# EasyEDA schematic SCH_STMv2_2025-09-21.json

## Sheets
1 stepper driver: TITLE: Sheet_1; REV: 1.0; Date: 2025-07-05; Sheet: 1/1; Drawn By: ZacApelt; Company: Your Company
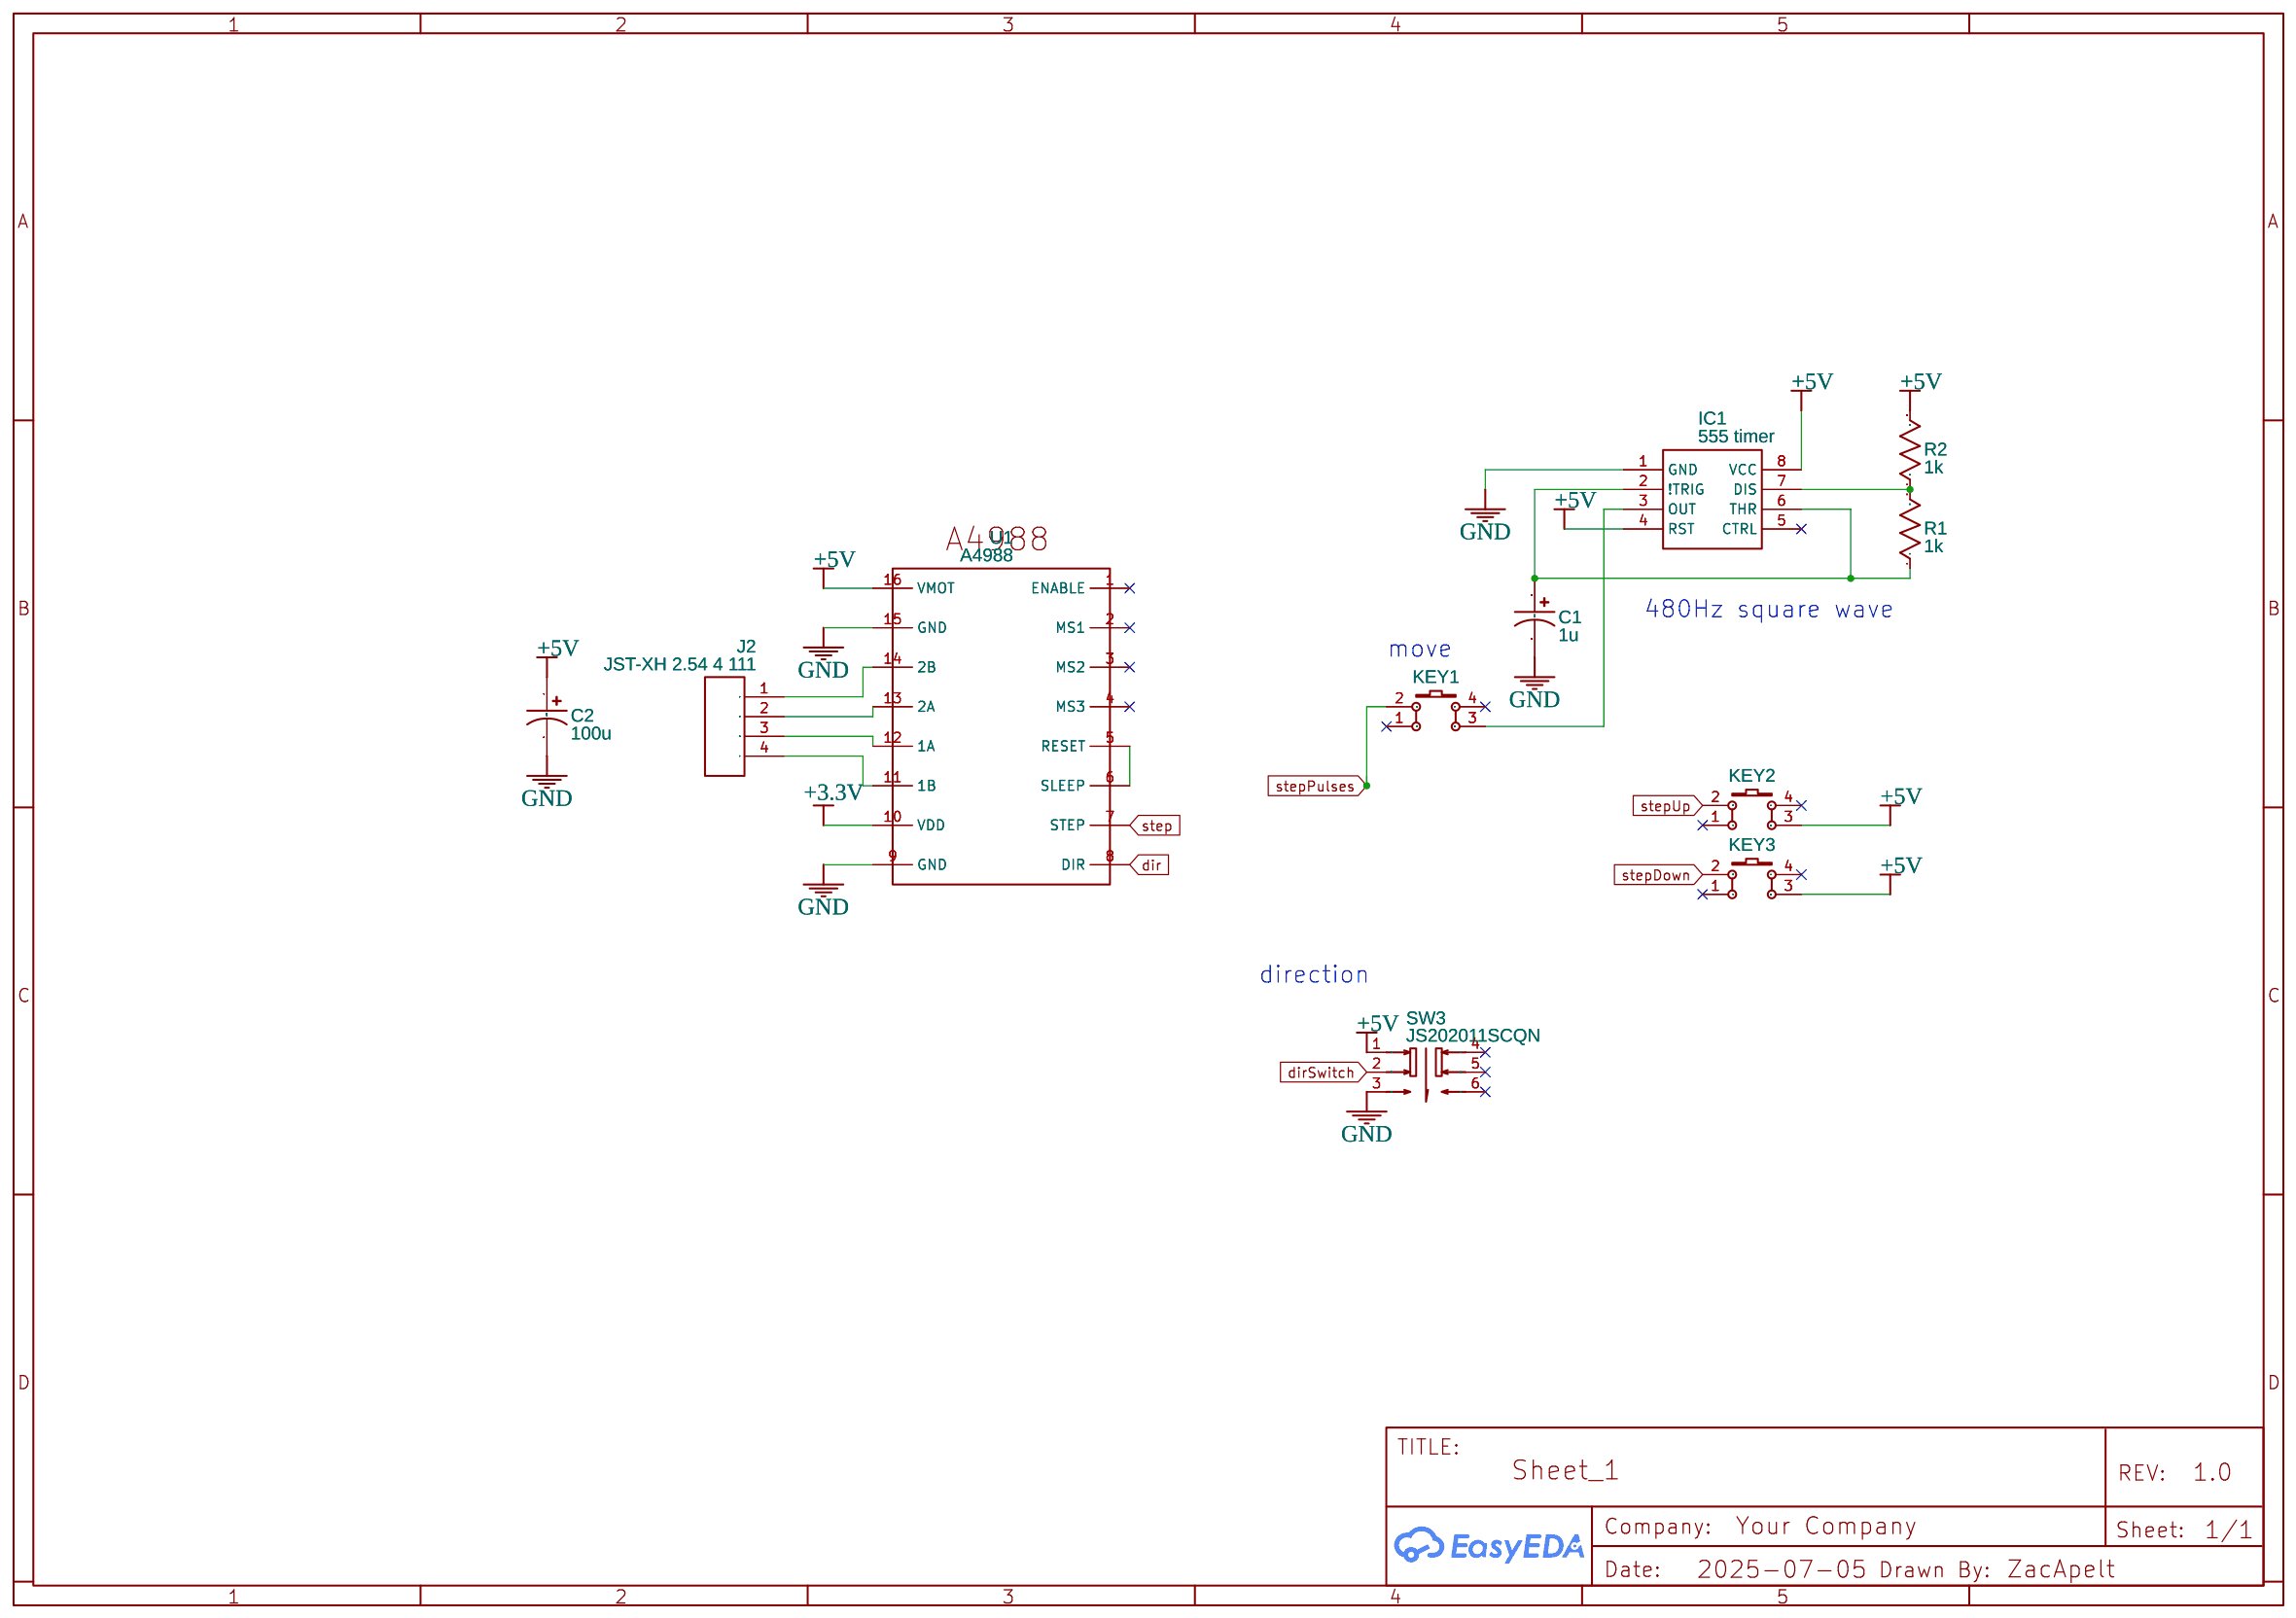
[diagram p0: stepper driver]
2 preamp
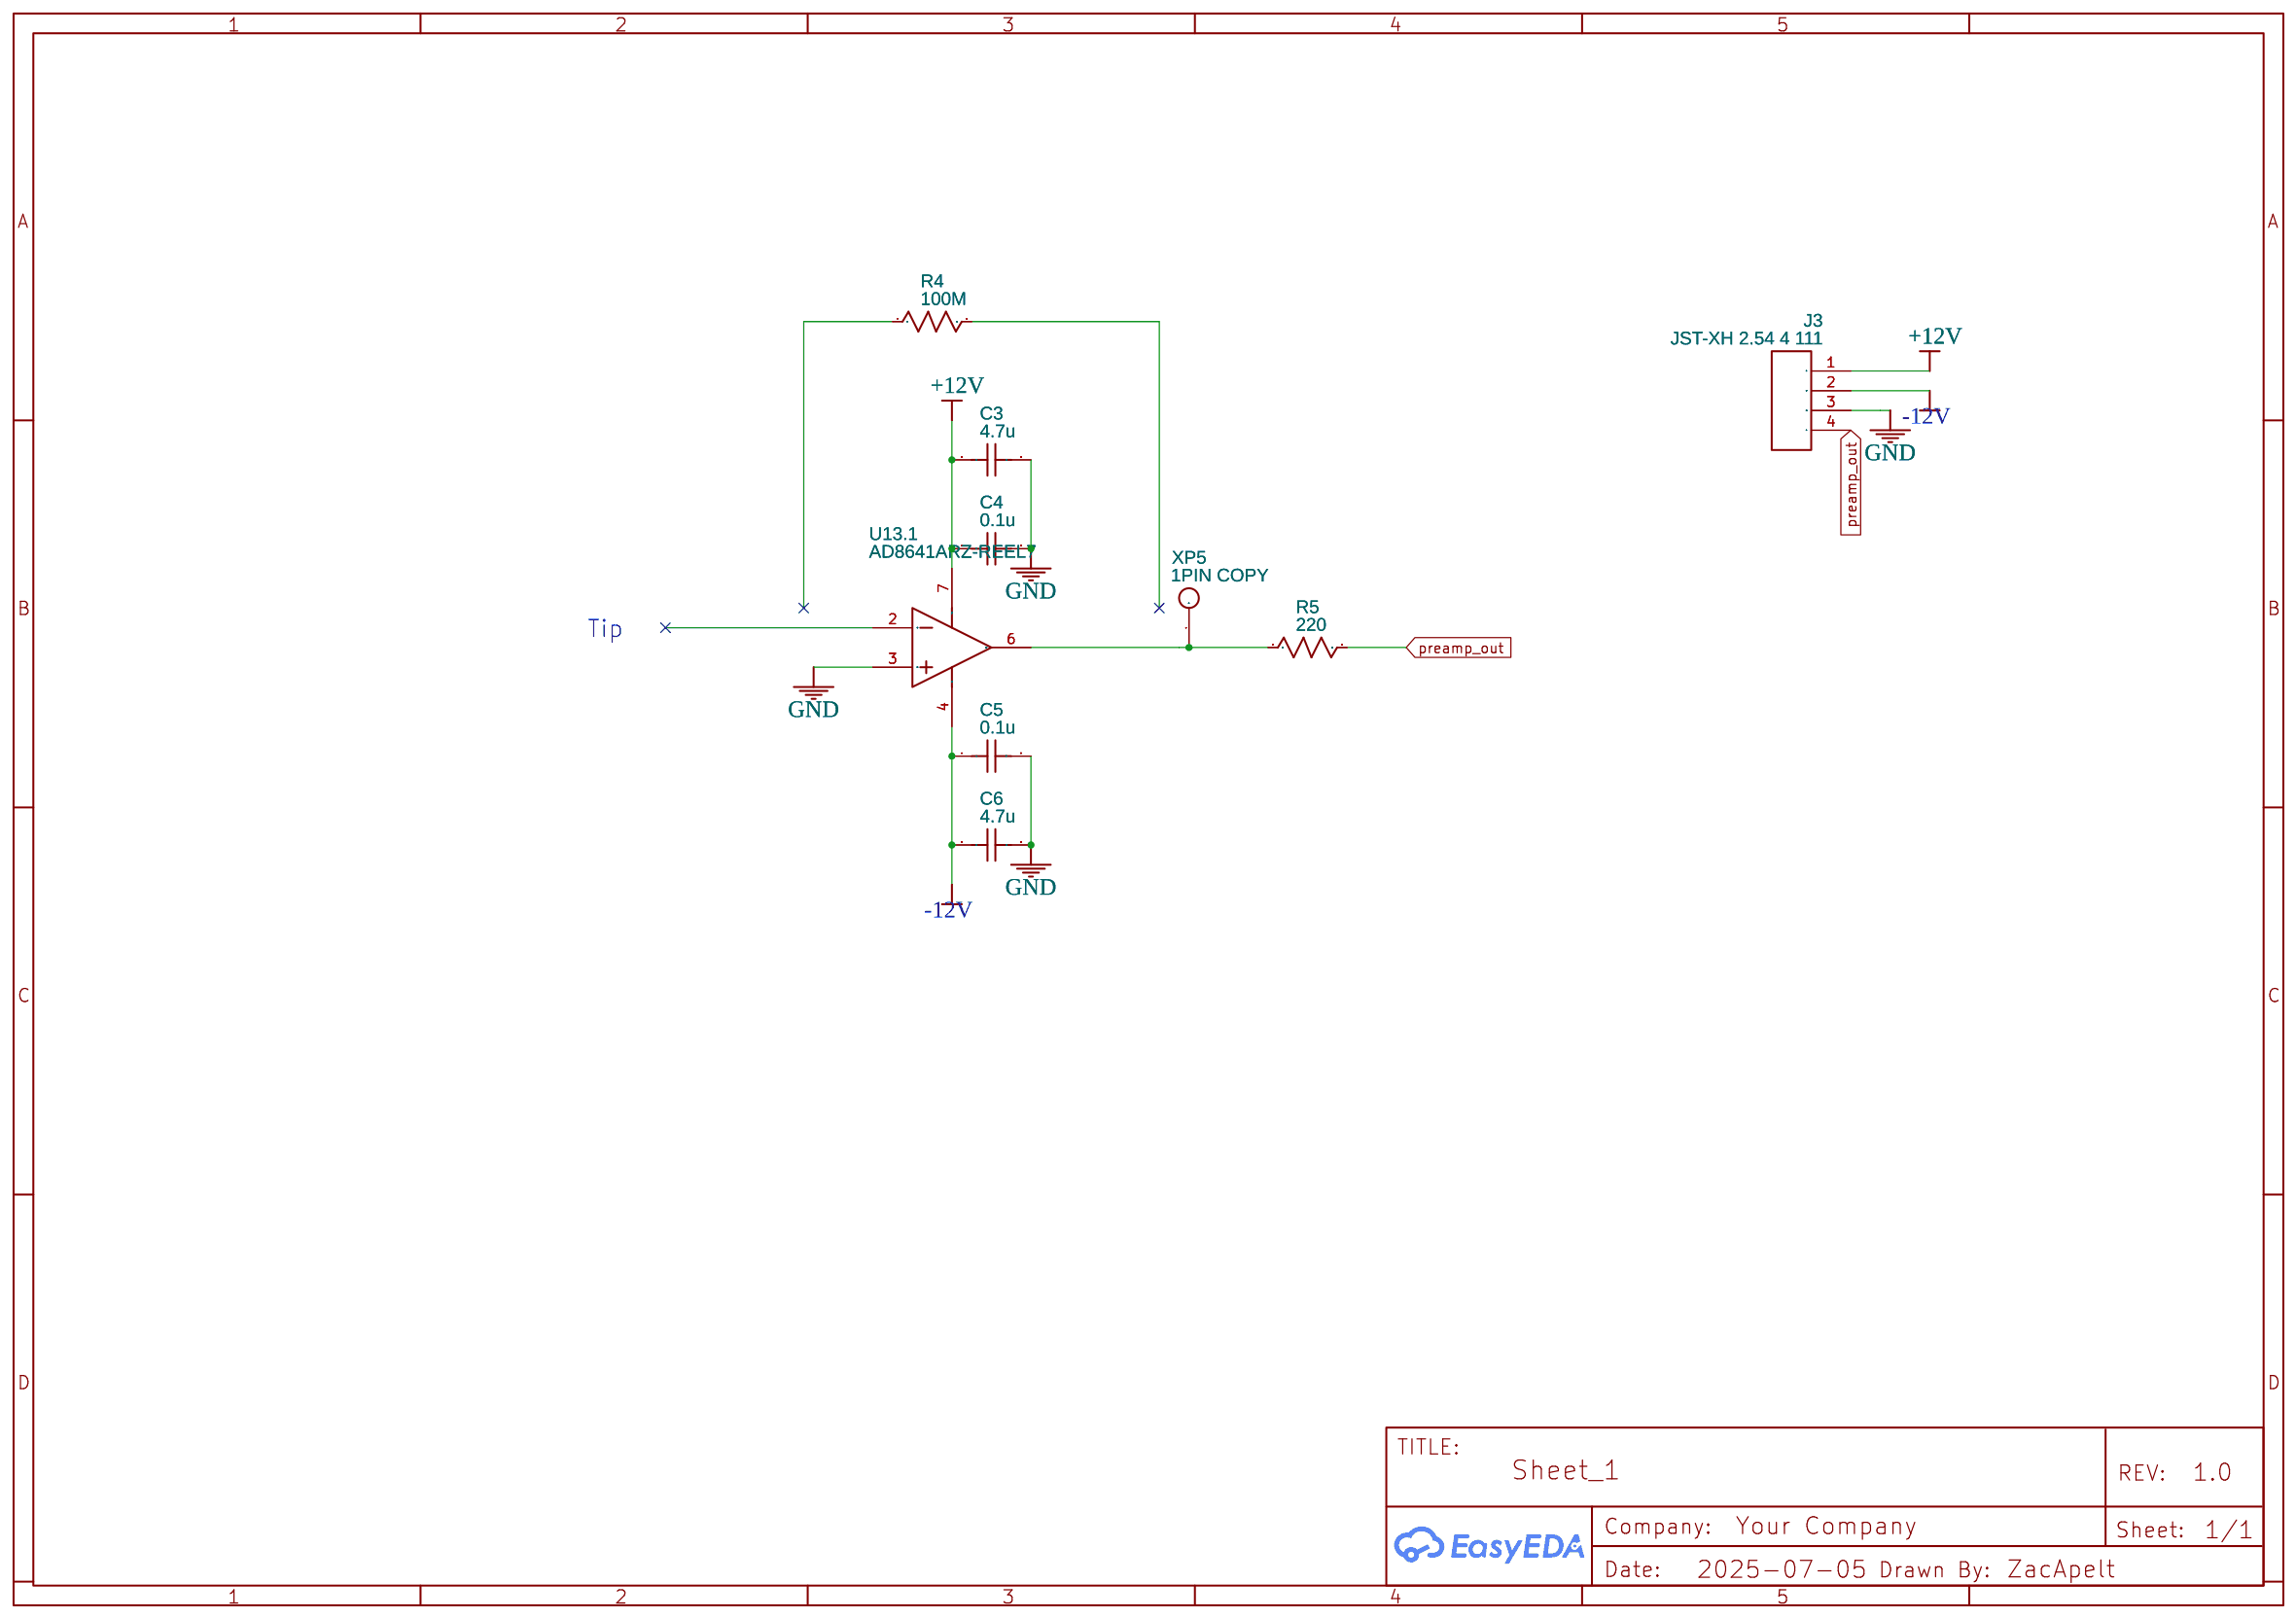
[diagram p1: preamp]
3 Control loop
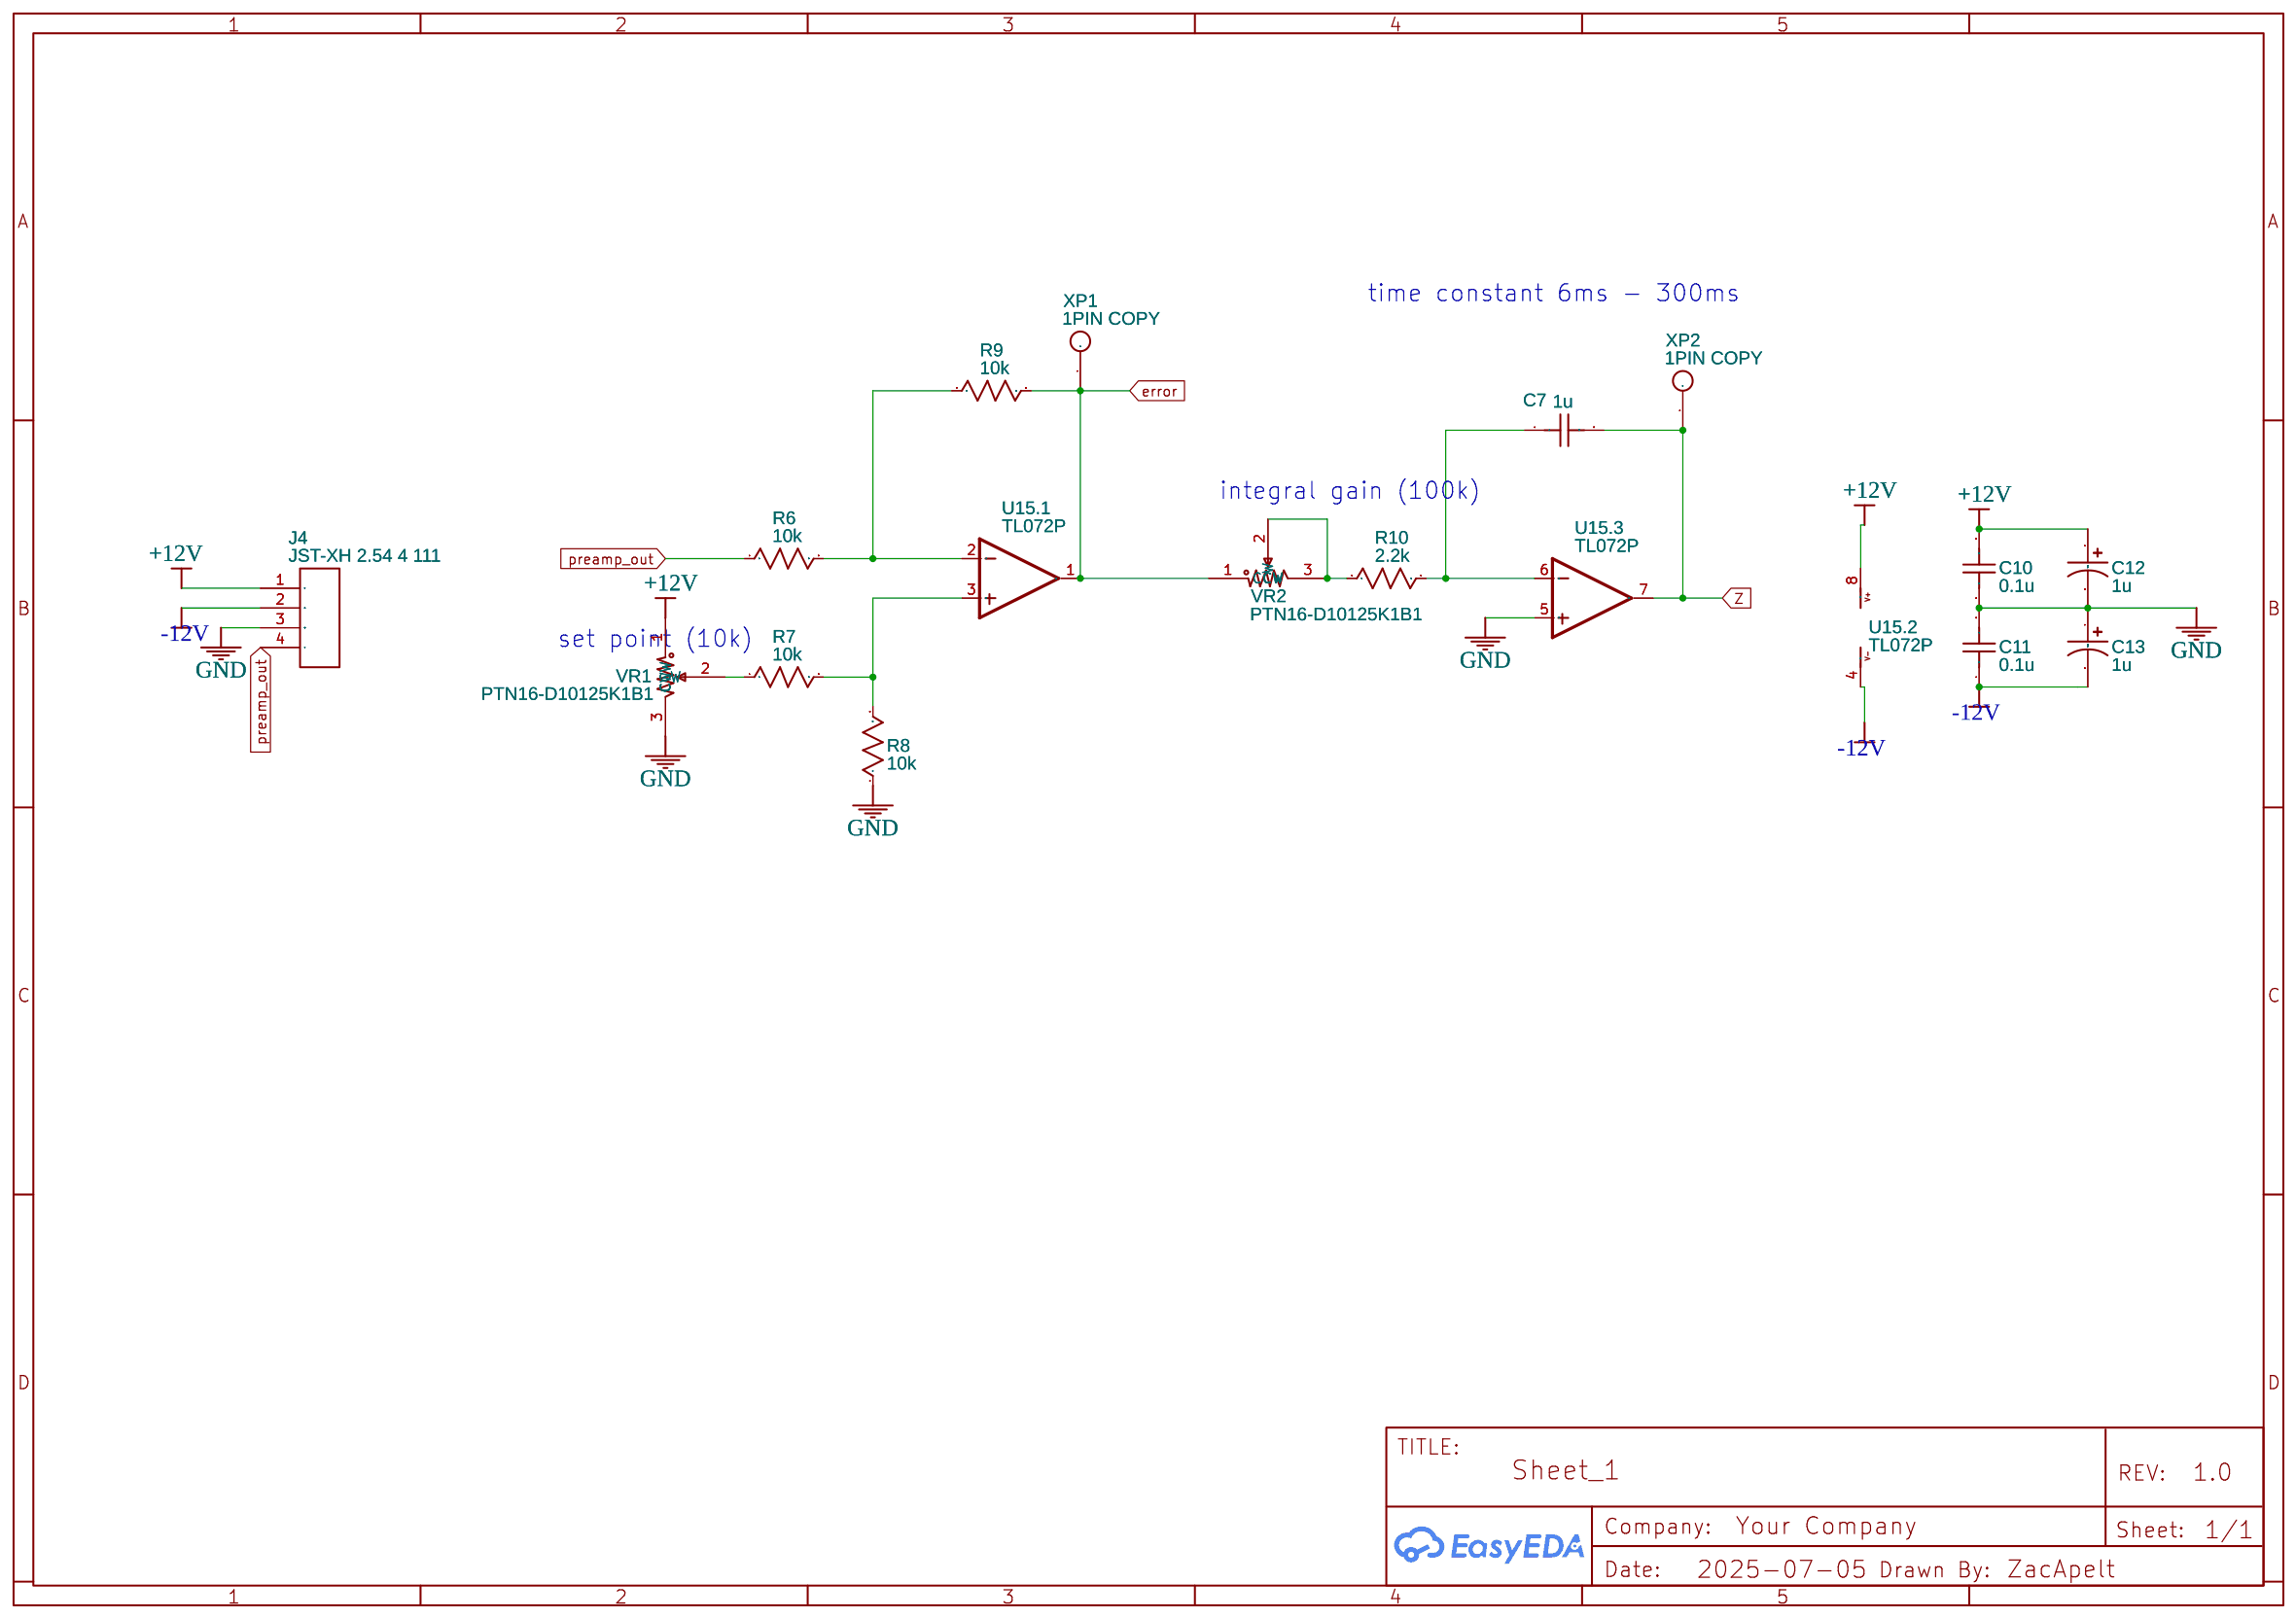
[diagram p2: Control loop]
4 piezo driver
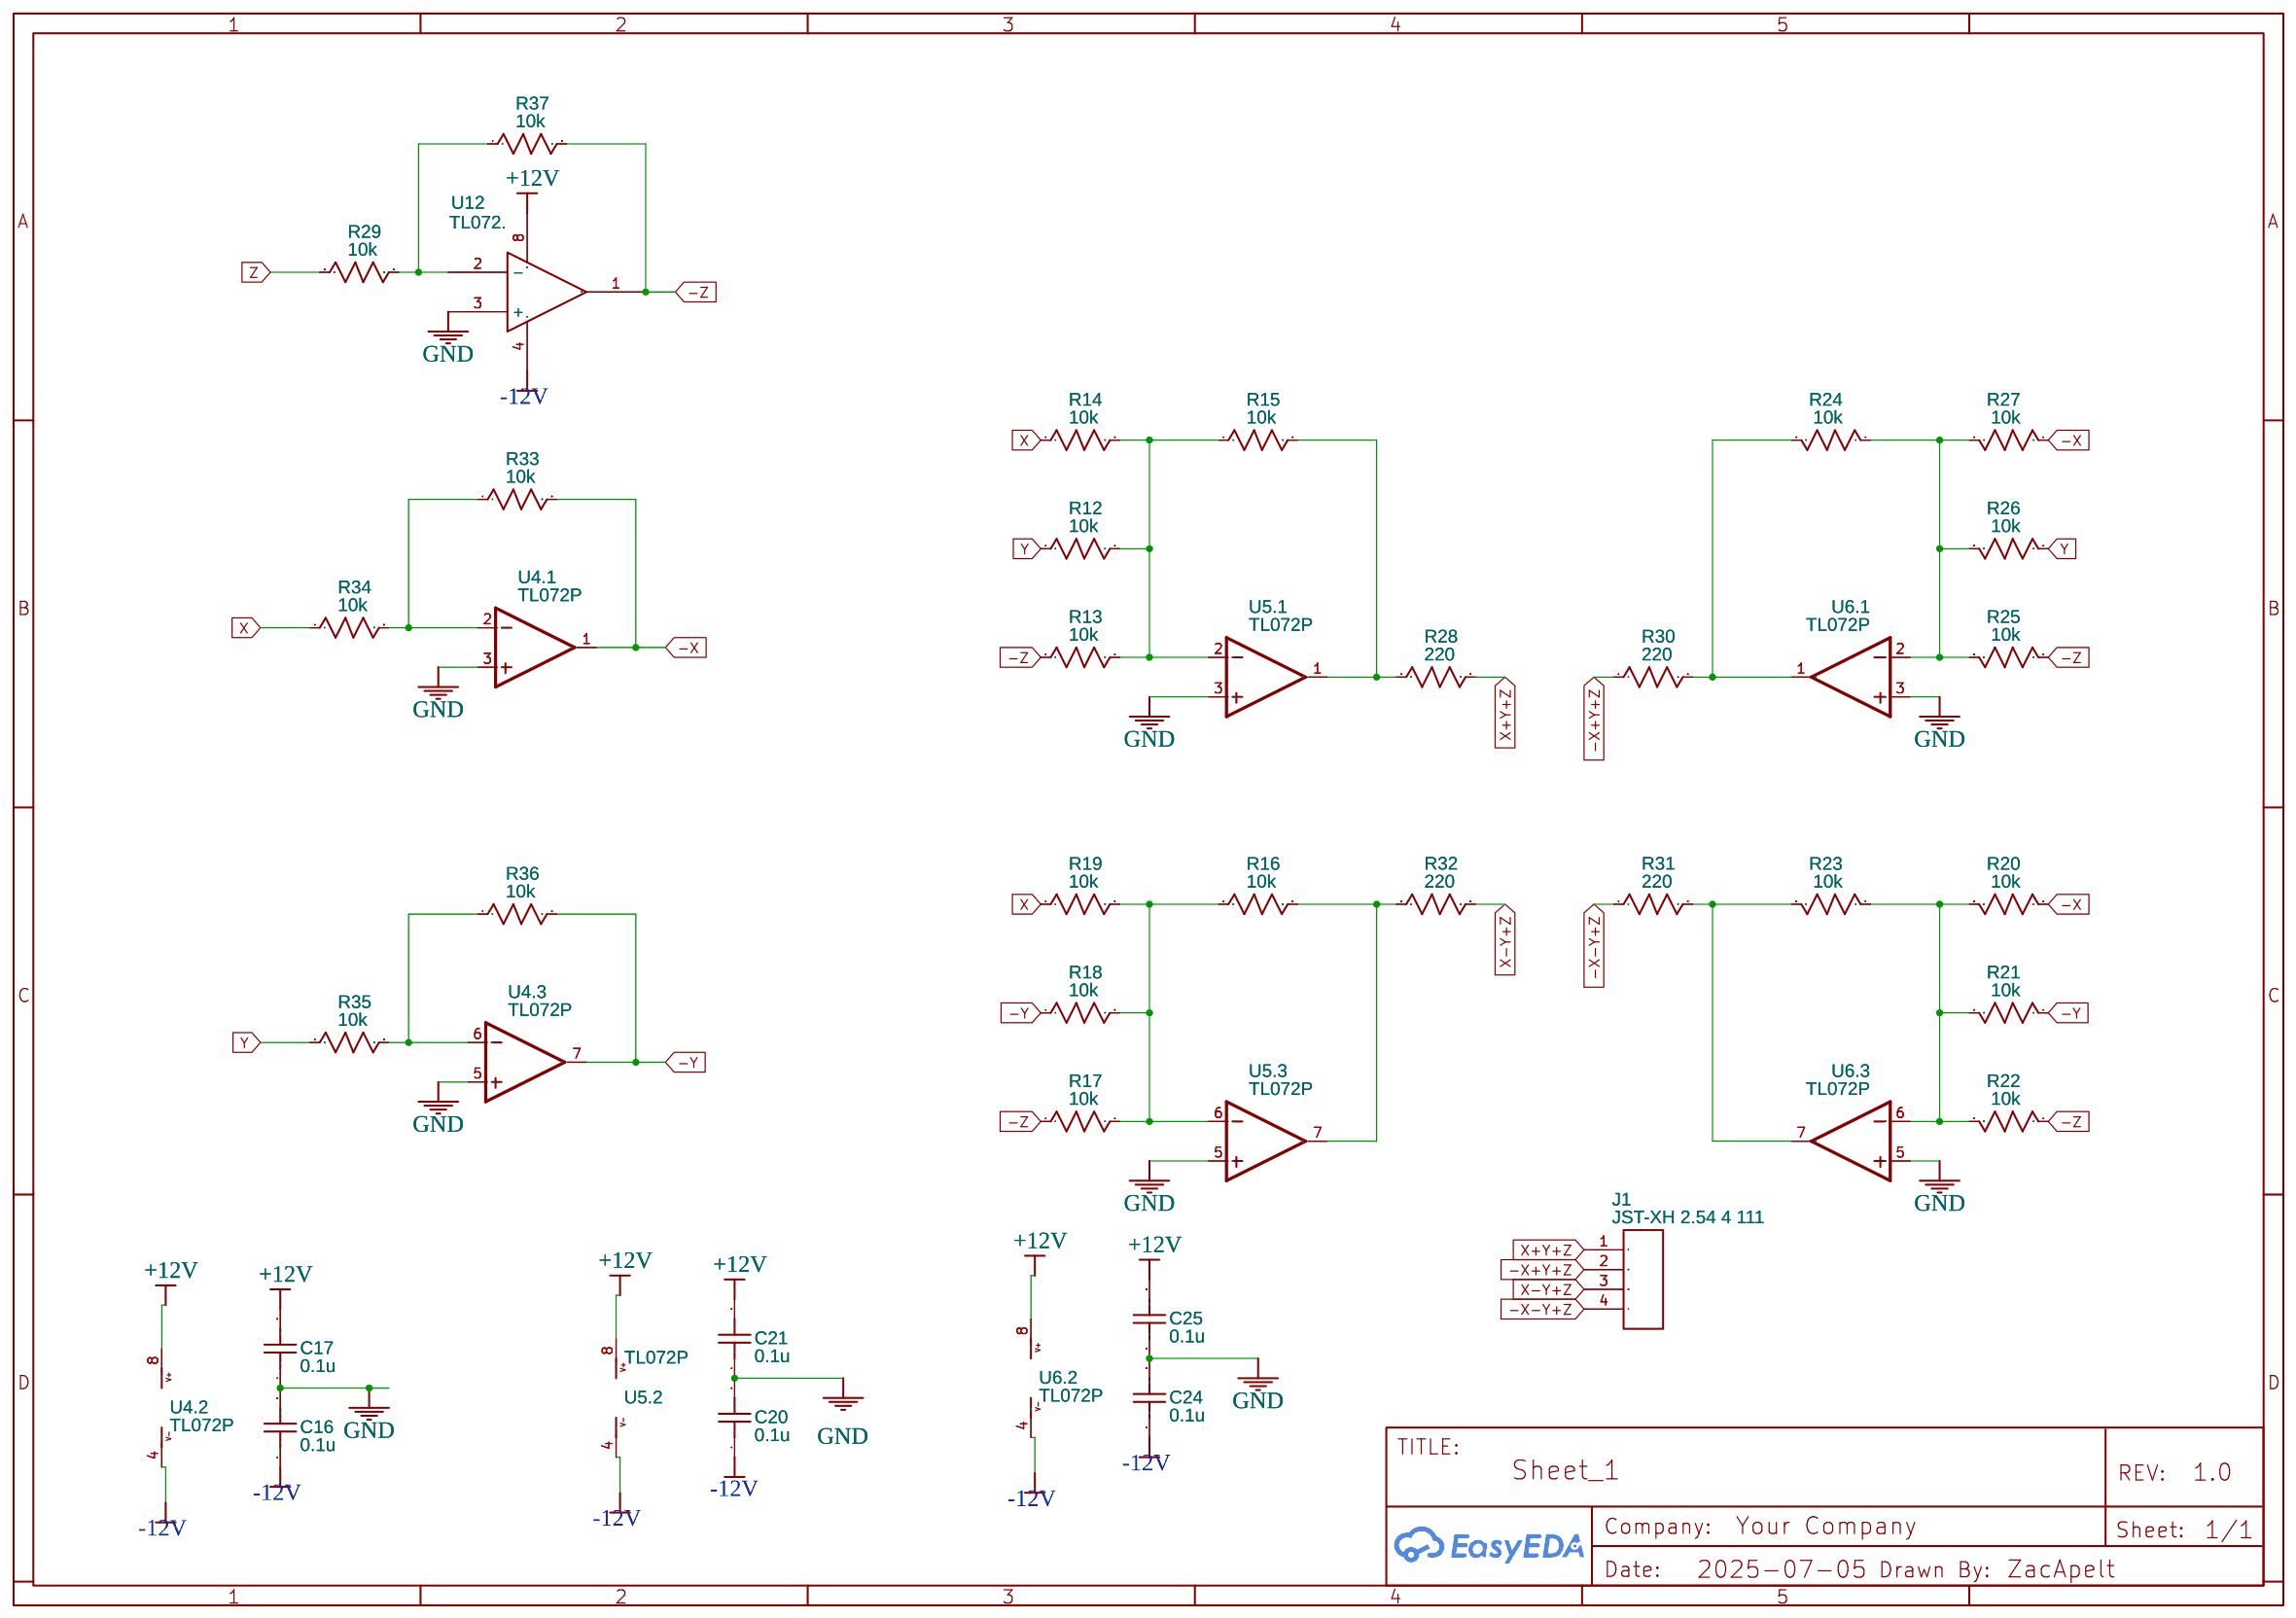
[diagram p3: piezo driver]
5 Pico Control: Date: 2025-07-13
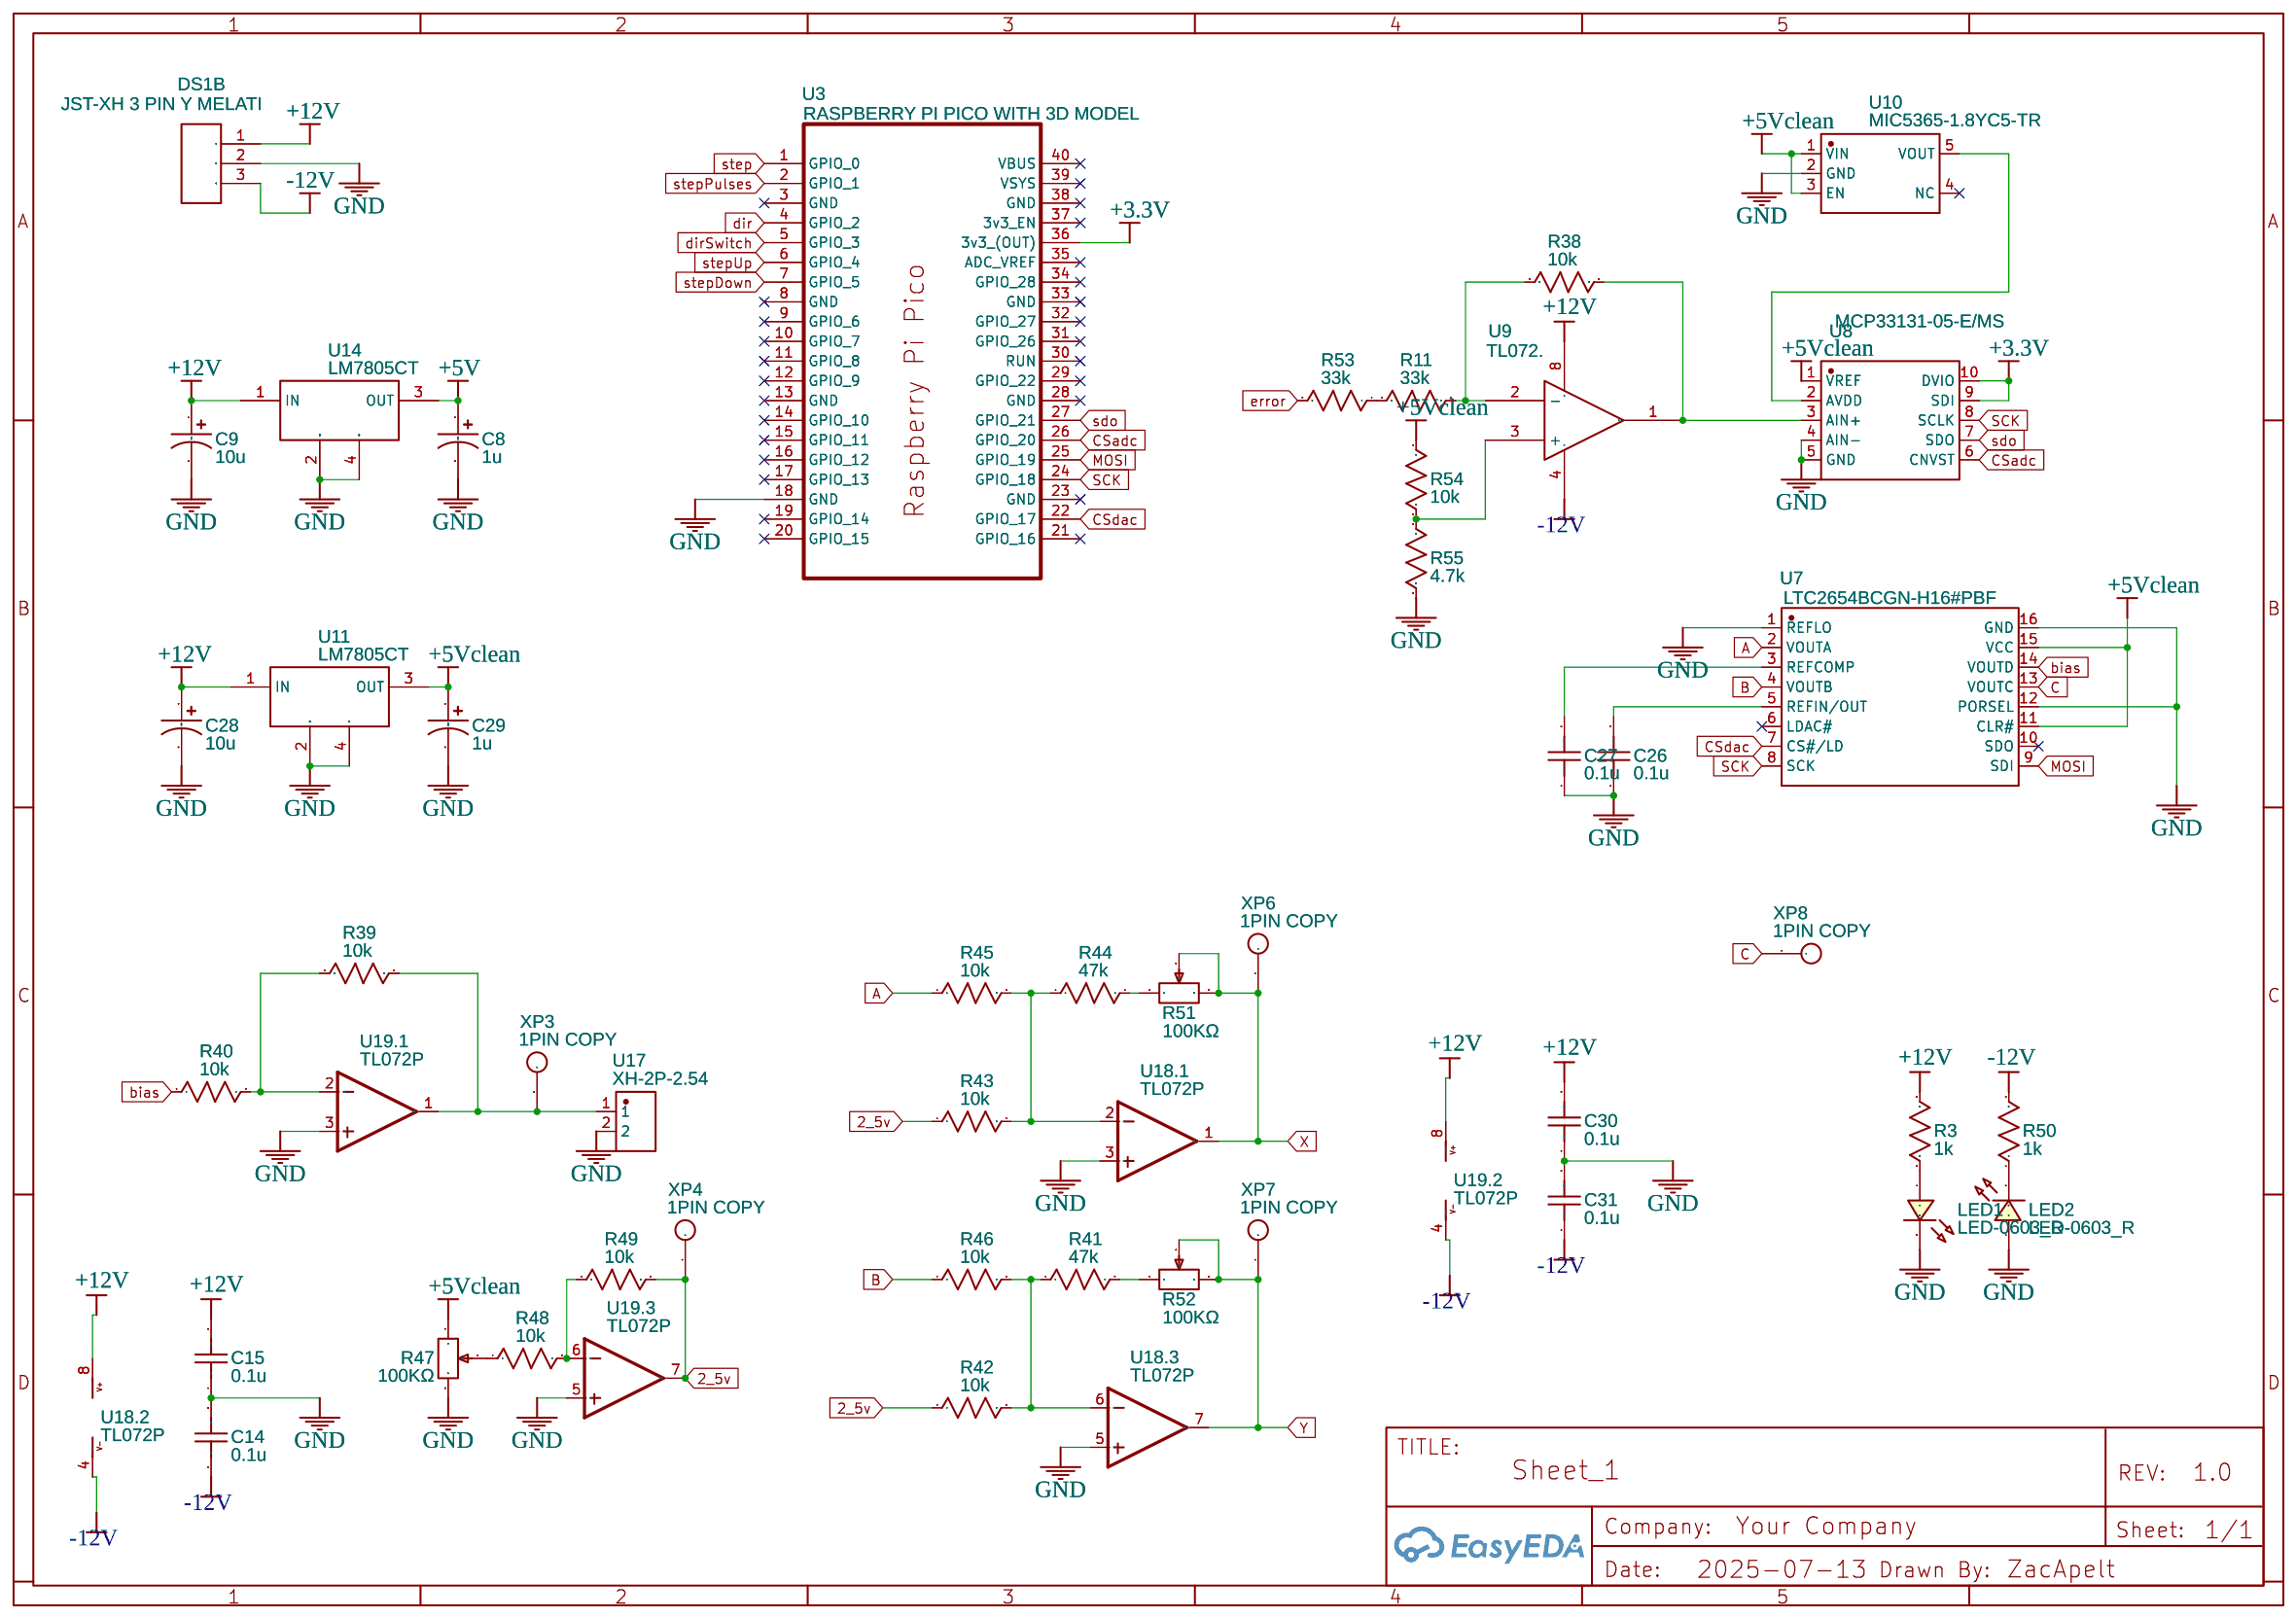
[diagram p4: Pico Control]

## Parts
sheet Control loop
C7  1u  [C0603]
C10  0.1u  [C0603]
C11  0.1u  [C0603]
C12  1u  [CAP-D5.0×F2.0]
C13  1u  [CAP-D5.0×F2.0]
J4  JST-XH 2.54 4 111  [4PIN_2.54_MM_JST_XHP_JST_CONNECTOR_FOR_DC_SOCKET]
R6  10k  [R0603]
R7  10k  [R0603]
R8  10k  [R0603]
R9  10k  [R0603]
R10  2.2k  [R0603]
U15  TL072P  [TL072P]  (sections 1,2,3)
VR1  PTN16-D10125K1B1  [PTN16D10125K1B1]
VR2  PTN16-D10125K1B1  [PTN16D10125K1B1]
XP1  1PIN COPY  [PIN1_RED COPY]
XP2  1PIN COPY  [PIN1_RED COPY]
sheet Pico Control
C8  1u  [CAP-D5.0×F2.0]
C9  10u  [CAP-D5.0×F2.0]
C14  0.1u  [C0603]
C15  0.1u  [C0603]
C26  0.1u  [C0603]
C27  0.1u  [C0603]
C28  10u  [CAP-D5.0×F2.0]
C29  1u  [CAP-D5.0×F2.0]
C30  0.1u  [C0603]
C31  0.1u  [C0603]
DS1B  JST-XH 3 PIN Y MELATI  [3PIN_2.54_MM_JST_XHP_JST_CONNECTOR_FOR_DC_SOCKET]
LED1  LED-0603_R  [LED0603_RED]
LED2  LED-0603_R  [LED0603_RED]
R3  1k  [R0603]
R11  33k  [R0603]
R38  10k  [R0603]
R39  10k  [R0603]
R40  10k  [R0603]
R41  47k  [R0603]
R42  10k  [R0603]
R43  10k  [R0603]
R44  47k  [R0603]
R45  10k  [R0603]
R46  10k  [R0603]
R47  100KΩ  [RES-ADJ_3296W]
R48  10k  [R0603]
R49  10k  [R0603]
R50  1k  [R0603]
R51  100KΩ  [RES-ADJ_3296W]
R52  100KΩ  [RES-ADJ_3296W]
R53  33k  [R0603]
R54  10k  [R0603]
R55  4.7k  [R0603]
U3  RASPBERRY PI PICO WITH 3D MODEL  [RASPBERRY PI PICO/ RASPBERRY PI PICO W]
U7  LTC2654BCGN-H16#PBF  [SSOP-16_L4.9-W3.9-P0.64-LS6.0-BL]
U8  MCP33131-05-E/MS  [MSOP-10_L3.0-W3.0-P0.50-LS4.9-BL]
U9  TL072.  [TL072]
U10  MIC5365-1.8YC5-TR  [SC-70-5_L2.0-W1.3-P0.65-LS2.1-BL]
U11  LM7805CT  [LM7805CT/SX]
U14  LM7805CT  [LM7805CT/SX]
U17  XH-2P-2.54  [CONN-TH_2P-P2.50-XH2.54-2P]
U18  TL072P  [TL072P]  (sections 1,2,3)
U19  TL072P  [TL072P]  (sections 1,2,3)
XP3  1PIN COPY  [PIN1_RED COPY]
XP4  1PIN COPY  [PIN1_RED COPY]
XP6  1PIN COPY  [PIN1_RED COPY]
XP7  1PIN COPY  [PIN1_RED COPY]
XP8  1PIN COPY  [PIN1_RED COPY]
sheet piezo driver
C16  0.1u  [C0603]
C17  0.1u  [C0603]
C20  0.1u  [C0603]
C21  0.1u  [C0603]
C24  0.1u  [C0603]
C25  0.1u  [C0603]
J1  JST-XH 2.54 4 111  [4PIN_2.54_MM_JST_XHP_JST_CONNECTOR_FOR_DC_SOCKET]
R12  10k  [R0603]
R13  10k  [R0603]
R14  10k  [R0603]
R15  10k  [R0603]
R16  10k  [R0603]
R17  10k  [R0603]
R18  10k  [R0603]
R19  10k  [R0603]
R20  10k  [R0603]
R21  10k  [R0603]
R22  10k  [R0603]
R23  10k  [R0603]
R24  10k  [R0603]
R25  10k  [R0603]
R26  10k  [R0603]
R27  10k  [R0603]
R28  220  [R0603]
R29  10k  [R0603]
R30  220  [R0603]
R31  220  [R0603]
R32  220  [R0603]
R33  10k  [R0603]
R34  10k  [R0603]
R35  10k  [R0603]
R36  10k  [R0603]
R37  10k  [R0603]
U4  TL072P  [TL072P]  (sections 1,2,3)
U5  TL072P  [TL072P]  (sections 1,2,3)
U6  TL072P  [TL072P]  (sections 1,2,3)
U12  TL072.  [TL072]
sheet preamp
C3  4.7u  [C0603]
C4  0.1u  [C0603]
C5  0.1u  [C0603]
C6  4.7u  [C0603]
J3  JST-XH 2.54 4 111  [4PIN_2.54_MM_JST_XHP_JST_CONNECTOR_FOR_DC_SOCKET]
R4  100M  [R0603]
R5  220  [R0603]
U13  AD8641ARZ-REEL7  [SOIC-8_L4.9-W3.9-P1.27-LS6.0-TL]  (section 1)
XP5  1PIN COPY  [PIN1_RED COPY]
sheet stepper driver
C1  1u  [CAP-D5.0×F2.0]
C2  100u  [CAP-D5.0×F2.0]
IC1  555 timer  [555TIMER]
J2  JST-XH 2.54 4 111  [4PIN_2.54_MM_JST_XHP_JST_CONNECTOR_FOR_DC_SOCKET]
KEY1  K4-6×6_SMD  [KEY-SMD_4P-L6.0-W6.0-P3.90-LS10.0]
KEY2  K4-6×6_SMD  [KEY-SMD_4P-L6.0-W6.0-P3.90-LS10.0]
KEY3  K4-6×6_SMD  [KEY-SMD_4P-L6.0-W6.0-P3.90-LS10.0]
R1  1k  [R0603]
R2  1k  [R0603]
SW3  JS202011SCQN  [SW-SMD_JS202011SCQN]
U1  A4988  [A4988]

## Library data of the parts
C3-C7 C10 C11 C14-C17 C20 C21 C24-C27 C30 C31 = C_0603_US: Contributor: LCEDA_Lib
C1 C2 C8 C9 C12 C13 C28 C29 = CE_TH_D5.0×F2.0_US: Contributor: LCEDA_Lib
J1-J4 = JST-XH 2.54 4 111: Contributor: moorpcbs
R1-R46 R48-R50 R53-R55 = R_0603_US: Contributor: LCEDA_Lib
U4-U6 U15 U18 U19 = TL072P: Manufacturer: The Art of Electronics; Manufacturer Part: The Art of Electronics; Supplier Part: The Art of Electronics; Contributor: dood556; subpart_no: 1
VR1 VR2 = PTN16-D10125K1B1
XP1-XP8 = 1PIN COPY: Contributor: kimdaihai
DS1B = JST-XH 3 PIN Y MELATI: Contributor: susiloseptember
LED1 LED2 = LED-0603_R: Manufacturer: EVERLIGHT(台湾亿光); Manufacturer Part: 19-217/R6C-AL1M2VY/3T; Supplier Part: C72044; Supplier: LCSC; Contributor: LCEDA_01
R47 R51 R52 = 3296W-1-104LF: Supplier: LCSC; Manufacturer: Bochen; Contributor: LCSC; Supplier Part: C118963
U3 = RASPBERRY PI PICO WITH 3D MODEL: Contributor: sunilgoud410
U7 = LTC2654BCGN-H16#PBF: Contributor: LCSC; Supplier: LCSC; Supplier Part: C682417; Manufacturer: ADI(亚德诺)
U8 = MCP33131-05-E/MS: Contributor: lcsc; Supplier: LCSC; Supplier Part: C635975; Manufacturer: MICROCHIP(美国微芯); JLCPCB Part Class: Extended Part
U9 U12 = TL072.: Contributor: pshiuu; subpart_no: 2
U10 = MIC5365-1.8YC5-TR: Contributor: LCSC; Supplier: LCSC; Supplier Part: C626087; Manufacturer: MICROCHIP(美国微芯); JLCPCB Part Class: Extended Part
U11 U14 = LM7805CT: Manufacturer: TI; Manufacturer Part: LM7805CT/NOPB; Supplier Part: LM7805CT/NOPB; link: http:; Contributor: lamngo
U17 = XH-2P-2.54: Contributor: LCSC; Convert to PCB: Yes; Add into BOM: Yes; Supplier: LCSC; Supplier Part: C9900003929; Manufacturer: null; JLCPCB Part Class: Extended Part
U13 = AD8641ARZ-REEL7: subpart_no: 1; Supplier: LCSC; Supplier Part: C207687; Manufacturer: ADI(亚德诺); JLCPCB Part Class: Extended Part
IC1 = 555 timer: Contributor: MacAfeeje
KEY1-KEY3 = K4-6×6_SMD: Supplier Part: C191626; Supplier: LCSC; Manufacturer: 韩国韩荣; Manufacturer Part: K2-6639SP-D4SC-04; Contributor: LCEDA_Lib
SW3 = JS202011SCQN: Supplier: LCSC; Supplier Part: C221666; Manufacturer: C&K; Contributor: LCSC; JLCPCB Part Class: Extended Part
U1 = A4988: Contributor: Luiti

## Nets
+3.3V: U1.10(VDD) U3.36(3v3 (OUT)) U8.9(SDI) U8.10(DVIO)
+5V: C2.1 C8.1 IC1.4(RST) IC1.8(VCC) KEY2.3 KEY3.3 R2.2 SW3.1 U1.16(VMOT) U14.3(OUT)
+5Vclean: C29.1 R47.1 R54.1 U7.11(CLR#) U7.15(VCC) U8.1(VREF) U10.1(VIN) U10.3(EN) U11.3(OUT)
+12V: C3.1 C4.1 C9.1 C10.2 C12.1 C15.2 C17.2 C21.2 C25.2 C28.1 C30.2 DS1B.1 J3.1 J4.1 R3.2 U4.8(V+) U5.8(V+) U6.8(V+) U9.8(V+) U11.1(IN) U12.8(V+) U13.7(VCC) U14.1(IN) U15.8(V+) U18.8(V+) U19.8(V+) VR1.1(CCW)
-12V: C5.1 C6.1 C11.1 C13.2 C14.1 C16.1 C20.1 C24.1 C31.1 DS1B.3 J3.2 J4.2 R50.2 U4.4(V-) U5.4(V-) U6.4(V-) U9.4(V-) U12.4(V-) U13.4(VEE) U15.4(V-) U18.4(V-) U19.4(V-)
GND: C1.2 C2.2 C3.2 C4.2 C5.2 C6.2 C8.2 C9.2 C10.1 C11.2 C12.2 C13.1 C14.2 C15.1 C16.2 C17.1 C20.2 C21.1 C24.2 C25.1 C26.1 C27.1 C28.2 C29.2 C30.1 C31.2 DS1B.2 IC1.1(GND) J3.3 J4.3 LED1.2 LED2.1 R8.1 R47.3 R55.2 SW3.3 U1.9(GND) U1.15(GND) U3.18(GND) U4.3(+IN) U4.5(+IN) U5.3(+IN) U5.5(+IN) U6.3(+IN) U6.5(+IN) U7.1(REFLO) U7.12(PORSEL) U7.16(GND) U8.4(AIN-) U8.5(GND) U10.2(GND) U11.2(GND) U11.4(GND) U12.3(+) U13.3(+IN) U14.2(GND) U14.4(GND) U15.5(+IN) U17.2 U18.3(+IN) U18.5(+IN) U19.3(+IN) U19.5(+IN) VR1.3(CW)
2_5v: R42.1 R43.1 R49.2 U19.7(OUT) XP4.1
-X: R20.1 R27.1 R33.2 U4.1(OUT)
-X+Y+Z: J1.2 R30.1
-X-Y+Z: J1.4 R31.1
-Y: R18.1 R21.1 R36.2 U4.7(OUT)
-Z: R13.1 R17.1 R22.1 R25.1 R37.2 U12.1
A: R45.1 U7.2(VOUTA)
B: R46.1 U7.4(VOUTB)
bias: R40.1 U7.14(VOUTD)
C: U7.13(VOUTC) XP8.1
CSadc: U3.26(GPIO 20) U8.6(CNVST)
CSdac: U3.22(GPIO 17) U7.7(CS#/LD)
dir: U1.8(DIR) U3.4(GPIO 2)
dirSwitch: SW3.2 U3.5(GPIO 3)
error: R9.2 R53.2 U15.1(OUT) VR2.1(CCW) XP1.1
MOSI: U3.25(GPIO 19) U7.9(SDI)
preamp_out: J3.4 J4.4 R5.2 R6.1
SCK: U3.24(GPIO 18) U7.8(SCK) U8.8(SCLK)
sdo: U3.27(GPIO 21) U8.7(SDO)
step: U1.7(STEP) U3.1(GPIO 0)
stepDown: KEY3.2 U3.7(GPIO 5)
stepPulses: KEY1.2 U3.2(GPIO 1)
stepUp: KEY2.2 U3.6(GPIO 4)
X: R14.1 R19.1 R34.1 R51.2 R51.3 U18.1(OUT) XP6.1
X+Y+Z: J1.1 R28.2
X-Y+Z: J1.3 R32.2
Y: R12.1 R26.1 R35.1 R52.2 R52.3 U18.7(OUT) XP7.1
Z: C7.2 R29.1 U15.7(OUT) XP2.1
Net-(C1-1): C1.1 IC1.2(!TRIG) IC1.6(THR) R1.1
Net-(C7-1): C7.1 R10.2 U15.6(-IN)
Net-(C26-2): C26.2 U7.5(REFIN/OUT)
Net-(C27-2): C27.2 U7.3(REFCOMP)
Net-(IC1-3): IC1.3(OUT) KEY1.3
Net-(IC1-7): IC1.7(DIS) R1.2 R2.1
Net-(J2-1): J2.1 U1.14(2B)
Net-(J2-2): J2.2 U1.13(2A)
Net-(J2-3): J2.3 U1.12(1A)
Net-(J2-4): J2.4 U1.11(1B)
Net-(LED1-1): LED1.1 R3.1
Net-(LED2-2): LED2.2 R50.1
Net-(R5-1): R5.1 U13.6(OUT) XP5.1
Net-(R6-2): R6.2 R9.1 U15.2(-IN)
Net-(R7-1): R7.1 VR1.2(W)
Net-(R7-2): R7.2 R8.2 U15.3(+IN)
Net-(R10-1): R10.1 VR2.2(W) VR2.3(CW)
Net-(R11-1): R11.1 R38.2 U9.2(-)
Net-(R11-2): R11.2 R53.1
Net-(R12-2): R12.2 R13.2 R14.2 R15.1 U5.2(-IN)
Net-(R15-2): R15.2 R28.1 U5.1(OUT)
Net-(R16-1): R16.1 R17.2 R18.2 R19.2 U5.6(-IN)
Net-(R16-2): R16.2 R32.1 U5.7(OUT)
Net-(R20-2): R20.2 R21.2 R22.2 R23.1 U6.6(-IN)
Net-(R23-2): R23.2 R31.2 U6.7(OUT)
Net-(R24-1): R24.1 R25.2 R26.2 R27.2 U6.2(-IN)
Net-(R24-2): R24.2 R30.2 U6.1(OUT)
Net-(R29-2): R29.2 R37.1 U12.2(-)
Net-(R33-1): R33.1 R34.2 U4.2(-IN)
Net-(R35-2): R35.2 R36.1 U4.6(-IN)
Net-(R38-1): R38.1 U8.3(AIN+) U9.1
Net-(R39-1): R39.1 U17.1 U19.1(OUT) XP3.1
Net-(R39-2): R39.2 R40.2 U19.2(-IN)
Net-(R41-1): R41.1 R42.2 R46.2 U18.6(-IN)
Net-(R41-2): R41.2 R52.1
Net-(R43-2): R43.2 R44.1 R45.2 U18.2(-IN)
Net-(R44-2): R44.2 R51.1
Net-(R47-2): R47.2 R48.1
Net-(R48-2): R48.2 R49.1 U19.6(-IN)
Net-(R54-2): R54.2 R55.1 U9.3(+)
Net-(U1-5): U1.5(RESET) U1.6(SLEEP)
Net-(U8-2): U8.2(AVDD) U10.5(VOUT)

Not connected (* = marked no-connect by the designer): IC1 5(CTRL)*; KEY1 1* 4*; KEY2 1* 4*; KEY3 1* 4*; R4 1 2; SW3 4* 5* 6*; U1 1(ENABLE)* 2(MS1)* 3(MS2)* 4(MS3)*; U3 3(GND)* 8(GND)* 9(GPIO 6)* 10(GPIO 7)* 11(GPIO 8)* 12(GPIO 9)* 13(GND)* 14(GPIO 10)* 15(GPIO 11)* 16(GPIO 12)* 17(GPIO 13)* 19(GPIO 14)* 20(GPIO 15)* 21(GPIO 16)* 23(GND)* 28(GND)* 29(GPIO 22)* 30(RUN)* 31(GPIO 26)* 32(GPIO 27)* 33(GND)* 34(GPIO 28)* 35(ADC_VREF)* 37(3v3_EN)* 38(GND)* 39(VSYS)* 40(VBUS)*; U7 6(LDAC#)* 10(SDO)*; U10 4(NC)*; U13 2(-IN)

## Notes on the sheets
sheet 1
- 480Hz square wave
- move
- direction
sheet 2
- Tip
sheet 3
- time constant 6ms - 300ms
- integral gain (100k)
- set point (10k)
